# Altium project (3V-16V)-3.3V Regulator.PrjPcb
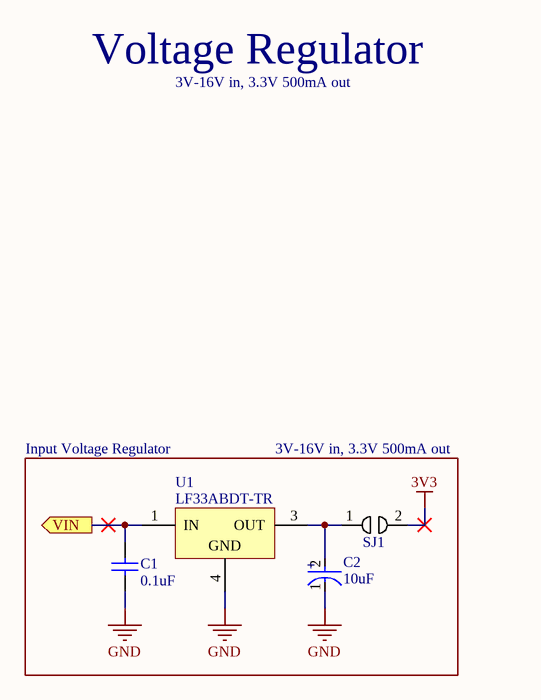
[diagram p0: (3V-16V)-3.3V Regulator.SchDoc]
1 sheet, 4 parts. Net scope: flat (ports and power ports of the same name join across sheets).
Board file: (3V-16V)-3.3V Regulator.PcbDoc

## Sheet (3V-16V)-3.3V Regulator.SchDoc: (3V-16V)-3.3V Regulator
size A4; CompanyName: Concordia SAE; DrawnBy: R.LOPEZ

### Parts
C1  0.1uF  [CAPC2013X95X45ML10T25]
C2  10uF  [FP-T491C-MFG]
SJ1  Jumper  [35MIL CIRCULAR]  (value not drawn)
U1  LF33ABDT-TR  [TO-252_N]

### Ports
VIN (out)

### Nets
3V3: SJ1.2
GND: C1.2 C2.1(C) U1.4(GND)
NetC1_1: C1.1 U1.1(IN) ; port VIN
NetC2_2: C2.2(A) SJ1.1 U1.3(OUT)

### Notes on the sheet
- Voltage Regulator
- 3V-16V in, 3.3V 500mA out
- Input Voltage Regulator
- (in symbol CMP-03017-000001-1) +

### Library data of the parts
C1 = CMP-2000-05017-1: Chip Capacitor, 0.1 uF, +/- 10%, 50 V, 0805 (2012 Metric), RoHS, Tape and Reel; Manufacturer: Samsung Electro-Mechanics; Manufacturer Part Number: CL21B104KBCNNNC; Dielectric: X7R; Capacitance: 100000pF; Rated Voltage: 50V; Material: Ceramic; Tolerance (%): ±10%; Case Size/Dimension: 0805; Datasheet URL: http://www.samsungsem.com/kr/support/product-search/mlcc/__icsFiles/afieldfile/2015/08/14/S_CL21B104KBCNNNC.pdf; Package Reference: 805; Package Description: 2-Pin Surface Mount Device, Body 2 x 1.25 mm; Manufacturer URL: http://www.samsungsem.com/global/index.jsp; Datasheet Version: Jun-15; Supplier 1: LCSC; Supplier Part Number 1: C1711; RoHS: Yes; Category: Ceramic Capacitors; Stock 1: 1573200; Pricing 1: 50=0.01180, 500=0.00860, 1500=0.00810, 5000=0.00750, 25000=0.00710, 50000=0.00710, 50=0.01140, 500=0.00830, 1500=0.00780, 5000=0.00720, 25000=0.00690, 50000=0.00680, 50=0.05850, 500=0.04280, 1500=0.04000, 5000=0.03710, 25000=0.03520, 50000=0.03490, 50=0.05440, 500=0.03980, 1500=0.03710, 5000=0.03450, 25000=0.03280, 50000=0.03250, 50=0.00730, 500=0.00530, 1500=0.00500, 5000=0.00460, 25000=0.00440, 50000=0.00440, 50=0.00670, 500=0.00490, 1500=0.00460, 5000=0.00420, 25000=0.00400, 50000=0.00400, 50=0.06710, 500=0.04910, 1500=0.04580, 5000=0.04260, 25000=0.04040, 50000=0.04010, 50=0.90790, 500=0.66380, 1500=0.61990, 5000=0.57600, 25000=0.54670, 50000=0.54190, 50=0.03570, 500=0.02610, 1500=0.02440, 5000=0.02270, 25000=0.02150, 50000=0.02130, 50=0.64940, 500=0.47480, 1500=0.44340, 5000=0.41200, 25000=0.39110, 50000=0.38760, 50=0.07600, 500=0.05560, 1500=0.05190, 5000=0.04820, 25000=0.04580, 50000=0.04530, 50=0.01170, 500=0.00860, 1500=0.00800, 5000=0.00750, 25000=0.00710, 50000=0.00700, 50=0.00866, 500=0.00633, 1500=0.00591, 5000=0.00549, 25000=0.00521, 50000=0.00517 (AUD); Mount: Surface Mount; Case/Package: 0805; Case Code (Metric): 2012; Case Code (Imperial): 0805; Contact Plating: Tin; Min Operating Temperature: -55°C; Max Operating Temperature: 125°C; Tolerance: 10%; Packaging: Tape and Reel; Voltage Rating: 50V; Voltage Rating (DC): 50V; Voltage: 50V; Length: 2mm; Height: 0.85mm; Width: 0.049inch; Depth: 1.25mm; Thickness: 0.037inch; Radiation Hardening: No; Lead Free: Lead Free; ComponentLink1URL: https://datasheet.ciiva.com/25710/cl21b104kbcnnnc-25710182.pdf?src-supplier=Digi-Key; ComponentLink1Description: https://datasheet.ciiva.com/25710/cl21b104kbcnnnc-25710182.pdf?src-supplier=Digi-Key; ComponentLink2URL: https://datasheet.ciiva.com/29199/454152-da-01-en-vs-kondensator-0805-29199814.pdf?src-supplier=Conrad; ComponentLink2Description: https://datasheet.ciiva.com/29199/454152-da-01-en-vs-kondensator-0805-29199814.pdf?src-supplier=Conrad; Supplier 2: Digi-Key; Supplier Part Number 2: 1276-1003-1-ND; Stock 2: 2187571; Pricing 2: 1=0.10000, 10=0.04700, 50=0.02560, 100=0.02100, 500=0.01498, 1000=0.01177 (USD)
C2 = CMP-03017-000001-1: CAP TANT 10UF 10% 25V 2312; Manufacturer Part Number: T491C106K025AT; Manufacturer: Kemet; Material: Tantalum; Standoff Height: 0mm; Life: 2000Hours; Dissipation Factor: 6%; Esr: 1.5Ω; Ripple Current: 271mA; Leakage Current: 2.5uA; ESR (Equivalent Series Resistance): 1.5R; Polarity: Polar; Life (Hours): 2000Hour; Digikey Description: CAP TANT 10UF 10% 25V 2312; Voltage Rating: 25V; Device Class L3: Tantalum Capacitors; ComponentLink2Description: Datasheet; Tolerance: 10%; Device Class L2: Capacitors; Temperature: -55°C to +125°C; Octopart: https://octopart.com/t491c106k025at-kemet-126002; Automotive: No; Height: 2.8mm; Package: T491C; Temperature Range Low: -55°C; Lead Free: Yes; Capacitance: 10uF; Category: Cap; Mouser Description: Tantalum Capacitors - Solid SMD 25V 10uF 10% C; Temperature Range High: +125°C; Value: 10uF; Device Class L1: Passive Components; ComponentLink2URL: https://content.kemet.com/datasheets/KEM_T2005_T491.pdf; RoHS: TRUE; Supplier 1: LCSC; Supplier Part Number 1: C116748; Stock 1: 623; Pricing 1: 1=0.31700, 10=0.23930, 30=0.22500, 100=0.21070, 500=0.20440, 1000=0.20130, 1=0.29970, 10=0.22620, 30=0.21270, 100=0.19920, 500=0.19320, 1000=0.19020, 1=1.52640, 10=1.15200, 30=1.08330, 100=1.01450, 500=0.98400, 1000=0.96900, 1=1.42850, 10=1.07820, 30=1.01380, 100=0.94950, 500=0.92090, 1000=0.90680, 1=0.19190, 10=0.14490, 30=0.13620, 100=0.12760, 500=0.12370, 1000=0.12180, 1=0.17590, 10=0.13280, 30=0.12490, 100=0.11690, 500=0.11340, 1000=0.11170, 1=1.73490, 10=1.30940, 30=1.23120, 100=1.15310, 500=1.11830, 1000=1.10130, 1=23.60010, 10=17.81210, 30=16.74900, 100=15.68590, 500=15.21330, 1000=14.98130, 1=0.93360, 10=0.70460, 30=0.66260, 100=0.62050, 500=0.60180, 1000=0.59260, 1=17.19740, 10=12.97970, 30=12.20510, 100=11.43040, 500=11.08600, 1000=10.91690, 1=2.01820, 10=1.52330, 30=1.43240, 100=1.34140, 500=1.30100, 1000=1.28120, 1=0.30740, 10=0.23200, 30=0.21810, 100=0.20430, 500=0.19810, 1000=0.19510, 1=0.22385, 10=0.16895, 30=0.15887, 100=0.14878, 500=0.14430, 1000=0.14210 (AUD); Mount: Surface Mount,PCB; Case/Package: Molded; Number of Pins: 2; Case Code (Imperial): 2412; Case Code (Metric): 6032; Dielectric Material: Tantalum; Min Operating Temperature: -55°C; Max Operating Temperature: 125°C; Package Quantity: 1; Packaging: Tape and Reel; Voltage Rating (DC): 25V; Termination: SMD/SMT; Voltage: 25V; Features: General Purpose; Length: 6mm; Width: 3.2mm; Depth: 3.2mm; Height - Seated (Max): 0.11inch; Radiation Hardening: No; REACH SVHC: No SVHC; ComponentLink1URL: https://datasheet.ciiva.com/23876/1732750-23876722.pdf?src-supplier=Newark; ComponentLink1Description: https://datasheet.ciiva.com/23876/1732750-23876722.pdf?src-supplier=Newark; ComponentLink3URL: https://datasheet.ciiva.com/11793/0900766b80718482-11793044.pdf?src-supplier=RSComponents; ComponentLink3Description: https://datasheet.ciiva.com/11793/0900766b80718482-11793044.pdf?src-supplier=RSComponents; ComponentLink4URL: https://datasheet.ciiva.com/258/kem-t2005-t491-258374.pdf?src-supplier=Digi-Key; ComponentLink4Description: https://datasheet.ciiva.com/258/kem-t2005-t491-258374.pdf?src-supplier=Digi-Key; ComponentLink5URL: https://datasheet.ciiva.com/20171/458351-da-en-01-20171926.pdf?src-supplier=Rapid+Electronics; ComponentLink5Description: https://datasheet.ciiva.com/20171/458351-da-en-01-20171926.pdf?src-supplier=Rapid+Electronics; ComponentLink6URL: https://datasheet.ciiva.com/34302/1573804-34302524.pdf?src-supplier=Jameco; ComponentLink6Description: https://datasheet.ciiva.com/34302/1573804-34302524.pdf?src-supplier=Jameco; ComponentLink7URL: https://datasheet.ciiva.com/26341/458351-da-01-en-kondensator-10uf-6032-10pr-25v-85c-26341615.pdf?src-supplier=Conrad; ComponentLink7Description: https://datasheet.ciiva.com/26341/458351-da-01-en-kondensator-10uf-6032-10pr-25v-85c-26341615.pdf?src-supplier=Conrad; ComponentLink8URL: https://datasheet.ciiva.com/258/kem-t2005-t491-258375.pdf?src-supplier=Digi-Key; ComponentLink8Description: https://datasheet.ciiva.com/258/kem-t2005-t491-258375.pdf?src-supplier=Digi-Key; ComponentLink9URL: https://datasheet.ciiva.com/258/kem-t2005-t491-258376.pdf?src-supplier=Digi-Key; ComponentLink9Description: https://datasheet.ciiva.com/258/kem-t2005-t491-258376.pdf?src-supplier=Digi-Key; ComponentLink10URL: https://datasheet.ciiva.com/14593/70095774-14593130.pdf?src-supplier=Allied+Electronics; ComponentLink10Description: https://datasheet.ciiva.com/14593/70095774-14593130.pdf?src-supplier=Allied+Electronics; ComponentLink11URL: https://datasheet.ciiva.com/7758/1732750-7758925.pdf?src-supplier=Element14; ComponentLink11Description: https://datasheet.ciiva.com/7758/1732750-7758925.pdf?src-supplier=Element14; ComponentLink12URL: https://datasheet.ciiva.com/7758/1698764-7758926.pdf?src-supplier=Element14; ComponentLink12Description: https://datasheet.ciiva.com/7758/1698764-7758926.pdf?src-supplier=Element14; ComponentLink13URL: https://datasheet.ciiva.com/41657/1854511-41657326.pdf?src-supplier=Farnell; ComponentLink13Description: https://datasheet.ciiva.com/41657/1854511-41657326.pdf?src-supplier=Farnell; ComponentLink14URL: https://datasheet.ciiva.com/7758/1732750-7758927.pdf?src-supplier=Element14; ComponentLink14Description: https://datasheet.ciiva.com/7758/1732750-7758927.pdf?src-supplier=Element14; Supplier 2: Digi-Key; Supplier Part Number 2: 399-3734-1-ND; Stock 2: 89543; Pricing 2: 1=0.57000, 10=0.40300, 50=0.30500, 100=0.26570 (USD)
SJ1 = Jumper: Solder Jumper to connect or disconnect a trace.
U1 = CMP-0244-00064-1: 500mA, Very Low Drop (0.45V) Voltage Regulator, 3.3V, 3-Pin DPAK, Tape and Reel; Manufacturer: STMicroelectronics; Number of Outputs: 1; Dropout Voltage: 400mV; Max Input Voltage: 16V; Min Input Voltage: 3V; Polarity: Positive; Accuracy: 1%; Output Type: Fixed; Quiescent Current: 1mA; Input Bias Current: 500uA; Min Supply Voltage: 4.3V; ComponentLink2Description: Datasheet; PackageDescription: 3-Pin Transistor Outline Package 2.28 mm Pitch, 9.7 mm Lead Span (DPAK); DatasheetVersion: 1/11/2010; ComponentLink1Description: Manufacturer URL; ComponentLink2URL: http://www.st.com/internet/com/TECHNICAL_RESOURCES/TECHNICAL_LITERATURE/DATASHEET/CD00000546.pdf; ComponentLink1URL: http://www.st.com; PackageVersion: 2011; PackageReference: TO-252; Supplier 1: Digi-Key; Supplier Part Number 1: 497-5225-1-ND; Manufacturer Part Number: LF33ABDT-TR; RoHS: Yes; Category: Voltage Regulators - Linear; Stock 1: 15972; Pricing 1: 1=0.84000, 10=0.74100, 25=0.69560, 100=0.52730, 250=0.44880, 500=0.42636, 1000=0.32538 (USD); Mount: Surface Mount; Case/Package: TO-252; Number of Pins: 3; Contact Plating: Tin,Matte; Min Operating Temperature: -40°C; Max Operating Temperature: 125°C; Output Voltage: 3.3V; Packaging: Tape and Reel; Output Current: 500mA; Max Output Current: 500mA; Package Quantity: 1; Number of Regulators: 1; Output Voltage Accuracy: 1%; Nominal Output Voltage: 3.3V; Min Output Voltage: 3.3V; Max Supply Voltage: 16V; Max Output Voltage: 3.3V; Termination: SMD/SMT; Voltage: 3.3V; Length: 6.6mm; Height: 2.4mm; Width: 6.2mm; Radiation Hardening: No; Lead Free: Lead Free; REACH SVHC: No SVHC; ComponentLink3URL: https://datasheet.ciiva.com/1511/1806095-1511654.pdf?src-supplier=Element14; ComponentLink3Description: https://datasheet.ciiva.com/1511/1806095-1511654.pdf?src-supplier=Element14; ComponentLink4URL: https://datasheet.ciiva.com/2043/cd00000546-2043943.pdf?src-supplier=Digi-Key; ComponentLink4Description: https://datasheet.ciiva.com/2043/cd00000546-2043943.pdf?src-supplier=Digi-Key; ComponentLink5URL: https://datasheet.ciiva.com/2043/cd00000546-2043944.pdf?src-supplier=Digi-Key; ComponentLink5Description: https://datasheet.ciiva.com/2043/cd00000546-2043944.pdf?src-supplier=Digi-Key; ComponentLink6URL: https://datasheet.ciiva.com/2043/cd00000546-2043945.pdf?src-supplier=Digi-Key; ComponentLink6Description: https://datasheet.ciiva.com/2043/cd00000546-2043945.pdf?src-supplier=Digi-Key; ComponentLink7URL: https://datasheet.ciiva.com/16392/cd00000546-16392073.pdf?src-supplier=Future+Electronics; ComponentLink7Description: https://datasheet.ciiva.com/16392/cd00000546-16392073.pdf?src-supplier=Future+Electronics; ComponentLink8URL: https://datasheet.ciiva.com/22694/1806095-22694861.pdf?src-supplier=Element14; ComponentLink8Description: https://datasheet.ciiva.com/22694/1806095-22694861.pdf?src-supplier=Element14; ComponentLink9URL: https://datasheet.ciiva.com/8228/cd00000546-8228718.pdf?src-supplier=Avnet; ComponentLink9Description: https://datasheet.ciiva.com/8228/cd00000546-8228718.pdf?src-supplier=Avnet; Supplier 2: LCSC; Supplier Part Number 2: C155553; Stock 2: 2475; Pricing 2: 1=0.93400, 10=0.69650, 30=0.65220, 100=0.61030, 500=0.58930, 1000=0.58000, 1=0.86950, 10=0.64830, 30=0.60710, 100=0.56810, 500=0.54860, 1000=0.53990, 1=4.52250, 10=3.37210, 30=3.15780, 100=2.95480, 500=2.85330, 1000=2.80820, 1=4.22740, 10=3.15210, 30=2.95180, 100=2.76200, 500=2.66710, 1000=2.62500, 1=0.56710, 10=0.42280, 30=0.39600, 100=0.37050, 500=0.35780, 1000=0.35210, 1=0.51000, 10=0.38020, 30=0.35610, 100=0.33320, 500=0.32170, 1000=0.31670, 1=4.94440, 10=3.68670, 30=3.45250, 100=3.23050, 500=3.11960, 1000=3.07020, 1=68.43220, 10=51.02550, 30=47.78310, 100=44.71120, 500=43.17540, 1000=42.49270, 1=2.73230, 10=2.03730, 30=1.90790, 100=1.78520, 500=1.72390, 1000=1.69660, 1=44.51330, 10=33.19070, 30=31.08160, 100=29.08340, 500=28.08440, 1000=27.64040, 1=5.96540, 10=4.44800, 30=4.16540, 100=3.89760, 500=3.76370, 1000=3.70420, 1=0.88960, 10=0.66330, 30=0.62120, 100=0.58130, 500=0.56130, 1000=0.55240, 1=0.63796, 10=0.47568, 30=0.44546, 100=0.41682, 500=0.40250, 1000=0.39614 (AUD)